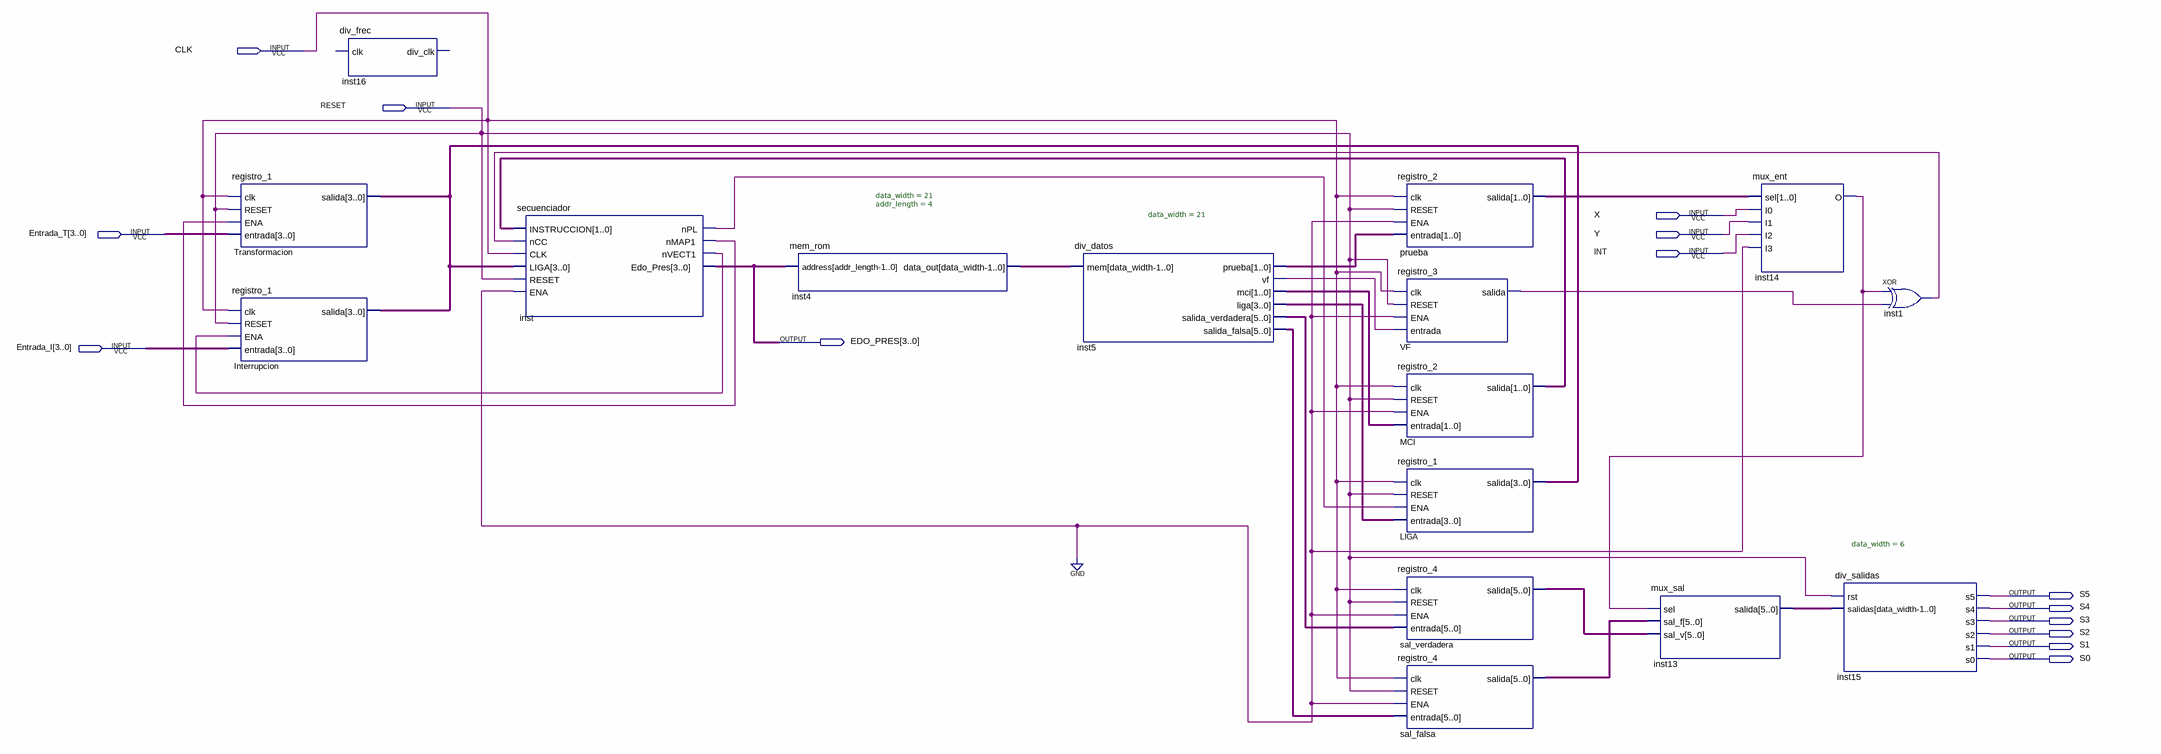
[diagram p0: schematic sheet]
// Quartus schematic Practica6.bdf as structural Verilog: 16 symbols, 14 pins
module Practica6 (
  input  CLK,
  input  RESET,
  input  X,
  input  [3:0] Entrada_T,
  input  Y,
  input  INT,
  input  [3:0] Entrada_I,
  output [3:0] EDO_PRES,
  output S5,
  output S4,
  output S3,
  output S2,
  output S1,
  output S0
);

  wire inst1_out, inst5_vf, inst14_o, inst_nmap1, inst_npl, inst_nvect1, VF_salida;
  wire [1:0] inst5_mci, inst5_prueba, MCI_salida, prueba_salida;
  wire [3:0] inst5_liga, Transformacion_salida;
  wire [5:0] inst5_salida_falsa, inst5_salida_verdadera, inst13_salida, sal_falsa_salida,
       sal_verdadera_salida;
  wire [20:0] inst4_data_out;

  registro_1 Transformacion (
    .clk(CLK), .RESET(RESET), .ENA(inst_nmap1), .entrada(Entrada_T), .salida(Transformacion_salida));
  registro_1 Interrupcion (
    .clk(CLK), .RESET(RESET), .ENA(inst_nvect1), .entrada(Entrada_I), .salida(Transformacion_salida));
  div_frec inst16 ();  // open: clk, div_clk
  secuenciador inst (
    .INSTRUCCION(MCI_salida), .nCC(inst1_out), .CLK(CLK), .LIGA(Transformacion_salida), .RESET(RESET),
    .ENA(1'b0), .nPL(inst_npl), .nMAP1(inst_nmap1), .nVECT1(inst_nvect1), .Edo_Pres(EDO_PRES));
  mem_rom #(.data_width(21), .addr_length(4)) inst4 (.address(EDO_PRES), .data_out(inst4_data_out));
  div_datos #(.data_width(21)) inst5 (
    .mem(inst4_data_out), .prueba(inst5_prueba), .vf(inst5_vf), .mci(inst5_mci), .liga(inst5_liga),
    .salida_verdadera(inst5_salida_verdadera), .salida_falsa(inst5_salida_falsa));
  registro_2 prueba (.clk(CLK), .RESET(RESET), .ENA(1'b0), .entrada(inst5_prueba), .salida(prueba_salida));
  registro_3 VF (.clk(CLK), .RESET(RESET), .ENA(1'b0), .entrada(inst5_vf), .salida(VF_salida));
  registro_2 MCI (.clk(CLK), .RESET(RESET), .ENA(1'b0), .entrada(inst5_mci), .salida(MCI_salida));
  registro_1 LIGA (.clk(CLK), .RESET(RESET), .ENA(inst_npl), .entrada(inst5_liga), .salida(Transformacion_salida));
  registro_4 sal_verdadera (
    .clk(CLK), .RESET(RESET), .ENA(1'b0), .entrada(inst5_salida_verdadera), .salida(sal_verdadera_salida));
  registro_4 sal_falsa (.clk(CLK), .RESET(RESET), .ENA(1'b0), .entrada(inst5_salida_falsa), .salida(sal_falsa_salida));
  mux_sal inst13 (.sel(inst14_o), .sal_f(sal_falsa_salida), .sal_v(sal_verdadera_salida), .salida(inst13_salida));
  mux_ent inst14 (.sel(prueba_salida), .I0(X), .I1(Y), .I2(INT), .I3(1'b0), .O(inst14_o));
  div_salidas #(.data_width(6)) inst15 (
    .rst(RESET), .salidas(inst13_salida), .s5(S5), .s4(S4), .s3(S3), .s2(S2), .s1(S1), .s0(S0));
  xor inst1 (inst1_out, inst14_o, VF_salida);
endmodule
